# EAGLE design m5stack-2sided-pinheader (EAGLE 8.7.1)
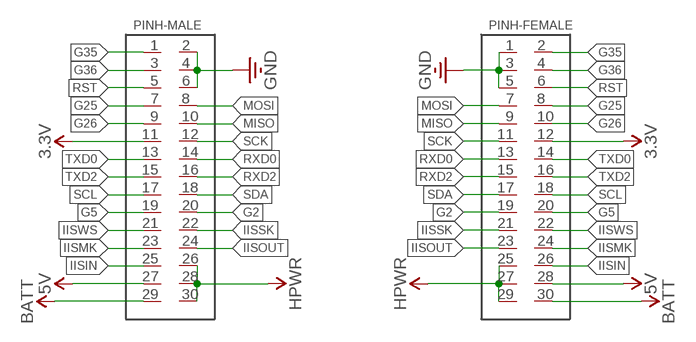
[diagram p0: schematic, sheet 1]

## Parts
PINH-FEMALE  M5STACK-PINHHANDSOLDER  [PINH-2X15-SMD_HANDSOLDER]
PINH-MALE  M5STACK-PINHHANDSOLDER  [PINH-2X15-SMD_HANDSOLDER]

## Nets
3.3V: PINH-FEMALE.12 PINH-MALE.11
5V: PINH-FEMALE.28 PINH-MALE.27
BATT: PINH-FEMALE.30 PINH-MALE.29
G2: PINH-FEMALE.19 PINH-MALE.20
G5: PINH-FEMALE.20 PINH-MALE.19
G25: PINH-FEMALE.8 PINH-MALE.7
G26: PINH-FEMALE.10 PINH-MALE.9
G35: PINH-FEMALE.2 PINH-MALE.1
G36: PINH-FEMALE.4 PINH-MALE.3
GND: PINH-FEMALE.1 PINH-FEMALE.3 PINH-FEMALE.5 PINH-MALE.2 PINH-MALE.4 PINH-MALE.6
HPWR: PINH-FEMALE.25 PINH-FEMALE.27 PINH-FEMALE.29 PINH-MALE.26 PINH-MALE.28 PINH-MALE.30
IISIN: PINH-FEMALE.26 PINH-MALE.25
IISMK: PINH-FEMALE.24 PINH-MALE.23
IISOUT: PINH-FEMALE.23 PINH-MALE.24
IISSK: PINH-FEMALE.21 PINH-MALE.22
IISWS: PINH-FEMALE.22 PINH-MALE.21
MISO: PINH-FEMALE.9 PINH-MALE.10
MOSI: PINH-FEMALE.7 PINH-MALE.8
RST: PINH-FEMALE.6 PINH-MALE.5
RXD0: PINH-FEMALE.13 PINH-MALE.14
RXD2: PINH-FEMALE.15 PINH-MALE.16
SCK: PINH-FEMALE.11 PINH-MALE.12
SCL: PINH-FEMALE.18 PINH-MALE.17
SDA: PINH-FEMALE.17 PINH-MALE.18
TXD0: PINH-FEMALE.14 PINH-MALE.13
TXD2: PINH-FEMALE.16 PINH-MALE.15

## Library data of the parts
PINH-FEMALE PINH-MALE = kenu-m5stack:M5STACK-PINH

## Board
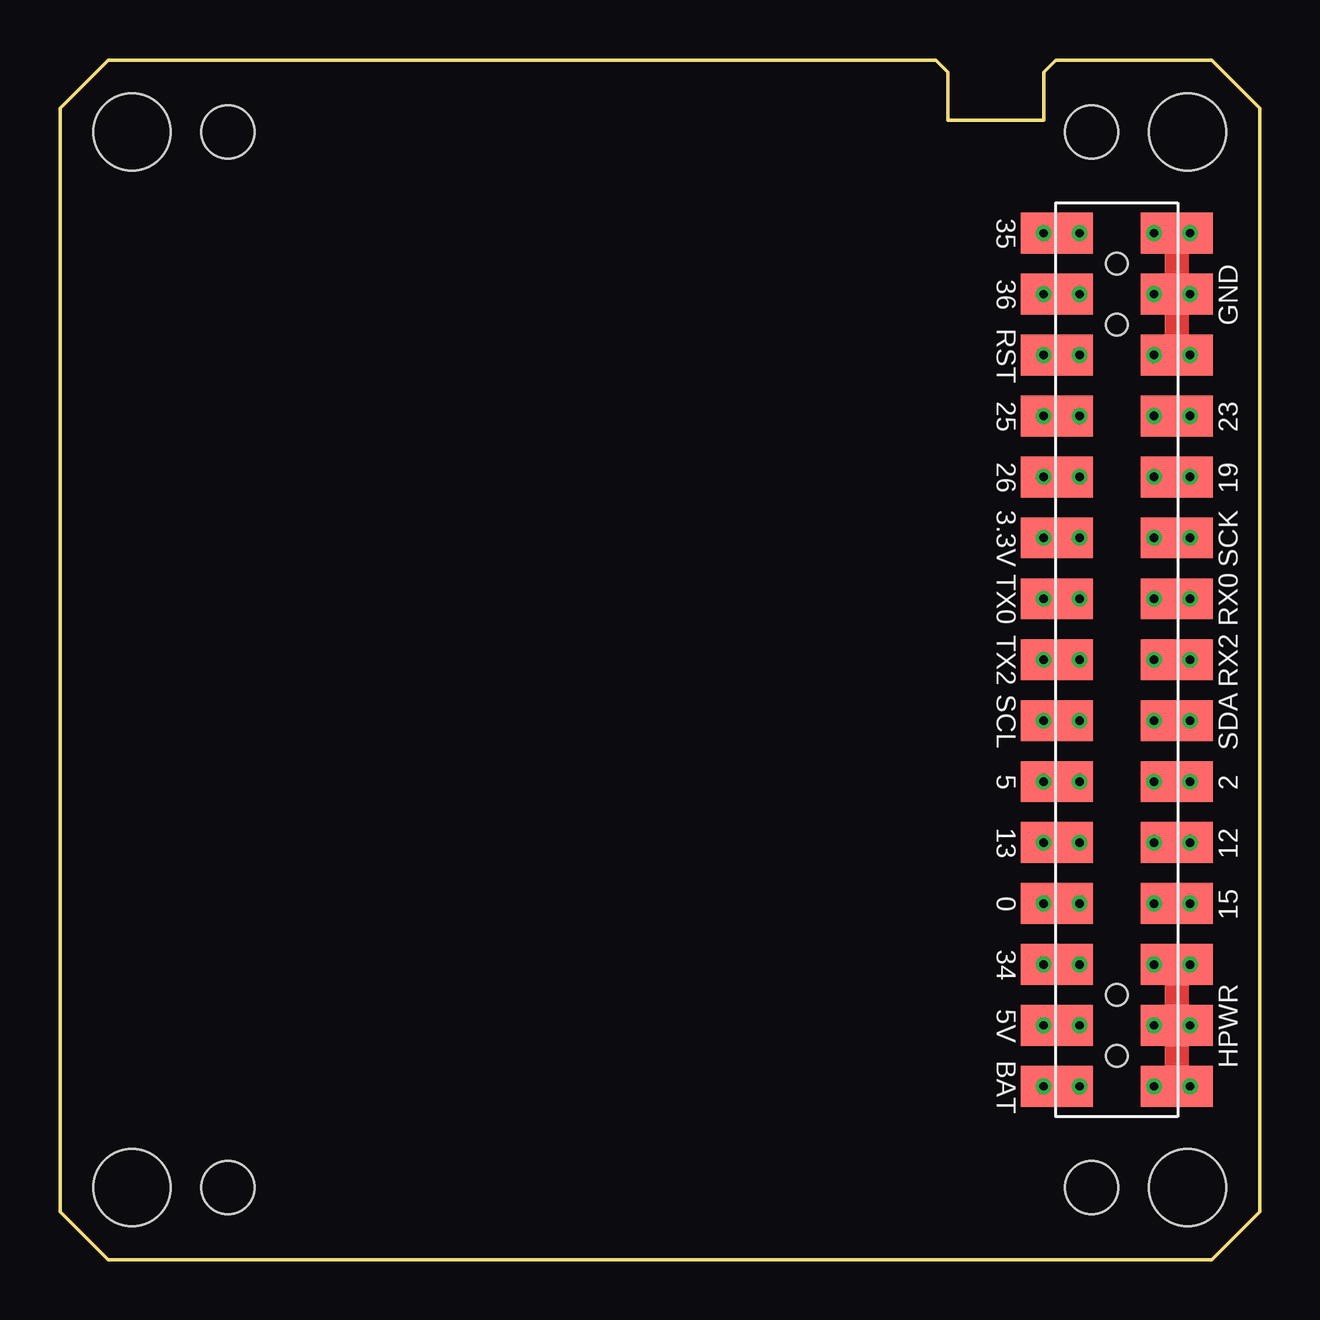
[diagram p1: board, top side]
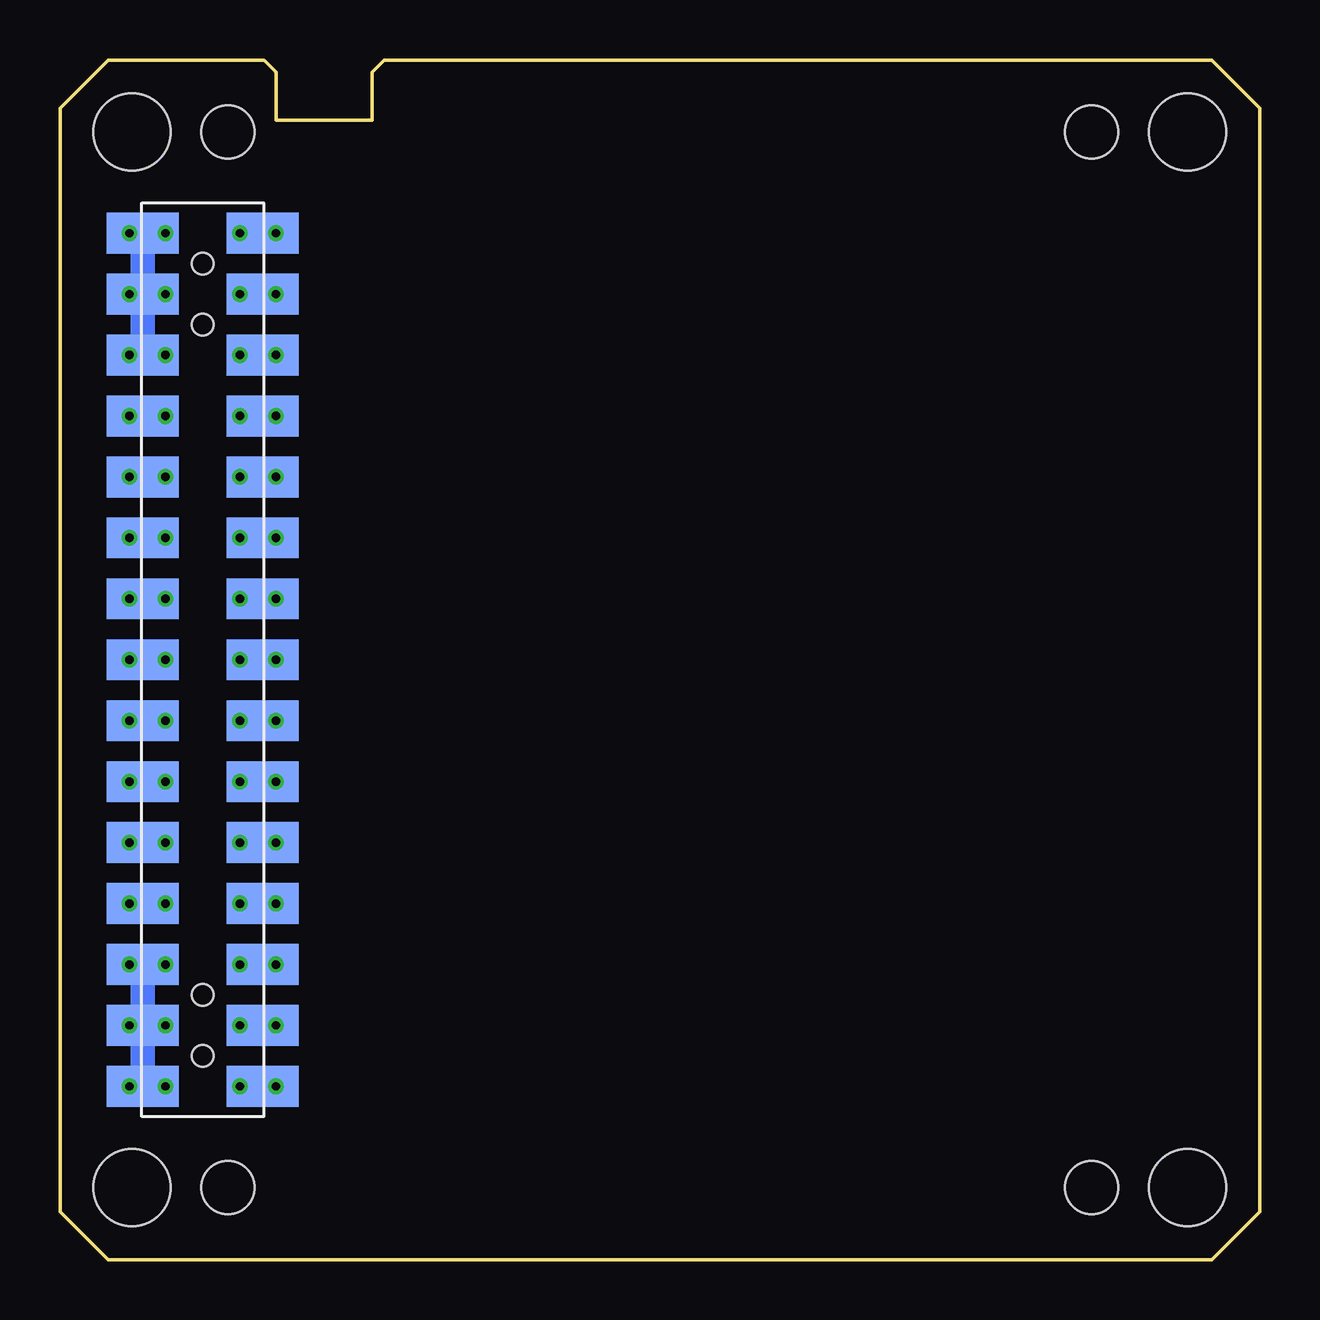
[diagram p2: board, bottom side, seen from below]

Size 50 x 50 mm. Coordinates in mm from the lower left corner, seen from the top.
Outline: 2,0 0,2 0,48 2,50 36.5,50 37,49.5 37,47.5 41,47.5 41,49.5 41.5,50 48,50 50,48 50,2 48,0 2,0
Copper layers (1*16): Top 0.035mm / dielectric 1.5mm / Bottom 0.035mm
Design rules "SeeedStudio_2layer_DRU_no_angle_20140221": minimum track width 6mil, minimum drill 12mil, track to track 6mil, track to pad 6mil, pad to pad 6mil, via to via 6mil, smd to smd 0mil, copper to edge 10mil, drill to drill 10mil, minimum pad ring 10mil, minimum via ring 6mil, stop-mask expansion 2mil, vias tented up to drill 100mil, thermal gap 10mil
Holes 3.2 mm at 3,47 3,3 47,47 47,3
Holes 2.2 mm at 7,47 7,3 43,3 43,47
Holes 0.9 mm at 44.05,41.51 44.05,38.97 44.05,11.03 44.05,8.49

### Footprints (pad centres in the part's own frame; a part is rotated, then mirrored left to right if it is on the bottom)
PINH-2X15-SMD_HANDSOLDER = smd 3 x 1.7: 1 -2.5,17.78; 2 2.5,17.78; 3 -2.5,15.24; 4 2.5,15.24; 5 -2.5,12.7; 6 2.5,12.7; 7 -2.5,10.16; 8 2.5,10.16; 9 -2.5,7.62; 10 2.5,7.62; 11 -2.5,5.08; 12 2.5,5.08; 13 -2.5,2.54; 14 2.5,2.54; 15 -2.5,0; 16 2.5,0; 17 -2.5,-2.54; 18 2.5,-2.54; 19 -2.5,-5.08; 20 2.5,-5.08; 21 -2.5,-7.62; 22 2.5,-7.62; 23 -2.5,-10.16; 24 2.5,-10.16; 25 -2.5,-12.7; 26 2.5,-12.7; 27 -2.5,-15.24; 28 2.5,-15.24; 29 -2.5,-17.78; 30 2.5,-17.78

### Placement (x,y rotation side)
PINH-FEMALE  44.05,25 0 bottom
PINH-MALE  44.05,25 0 top

### Tracks (layer width: path | path; a pad name or v marks a point on that pad's centre or on a via)
3.3V  (via drill 0.35)
  Top 0.152: v42.5,30.08 PINH-FEMALE.12 v41,30.08
  Bottom 0.152: v41,30.08 PINH-FEMALE.12 v42.5,30.08
5V  (via drill 0.35)
  Top 0.152: v41,9.76 PINH-FEMALE.28 v42.5,9.76
  Bottom 0.152: v42.5,9.76 PINH-FEMALE.28 v41,9.76
BATT  (via drill 0.35)
  Top 0.152: v41,7.22 PINH-FEMALE.30 v42.5,7.22
  Bottom 0.152: v41,7.22 PINH-FEMALE.30 v42.5,7.22
G2  (via drill 0.35)
  Top 0.152: v45.6,19.92 PINH-FEMALE.19 v47.1,19.92
  Bottom 0.152: v45.6,19.92 PINH-FEMALE.19 v47.1,19.92
G5  (via drill 0.35)
  Top 0.152: v42.5,19.92 PINH-FEMALE.20 v41,19.92
  Bottom 0.152: v41,19.92 PINH-FEMALE.20 v42.5,19.92
G25  (via drill 0.35)
  Top 0.152: v41,35.16 PINH-MALE.7 v42.5,35.16
  Bottom 0.152: v41,35.16 PINH-MALE.7 v42.5,35.16
G26  (via drill 0.35)
  Top 0.152: v41,32.62 PINH-MALE.9 v42.5,32.62
  Bottom 0.152: v41,32.62 PINH-MALE.9 v42.5,32.62
G35  (via drill 0.35)
  Top 0.152: v41,42.78 PINH-FEMALE.2 v42.5,42.78
  Bottom 0.152: v41,42.78 PINH-FEMALE.2 v42.5,42.78
G36  (via drill 0.35)
  Top 0.152: v41,40.24 PINH-MALE.3 v42.5,40.24
  Bottom 0.152: v41,40.24 PINH-MALE.3 v42.5,40.24
GND  (via drill 0.35)
  Top 0.152: v45.6,42.78 PINH-FEMALE.1 v47.1,42.78 | v45.6,37.7 PINH-FEMALE.5 v47.1,37.7 | PINH-FEMALE.3 v45.6,40.24
  Top 1.016: PINH-FEMALE.1 PINH-FEMALE.3 PINH-FEMALE.5
  Bottom 0.152: v45.6,40.24 PINH-FEMALE.3 v47.1,40.24 | v45.6,37.7 PINH-FEMALE.5 v47.1,37.7 | v47.1,42.78 PINH-FEMALE.1 v45.6,42.78
  Bottom 1.016: PINH-FEMALE.1 PINH-FEMALE.3 PINH-FEMALE.5
HPWR  (via drill 0.35)
  Top 0.152: v45.6,12.3 PINH-FEMALE.25 v47.1,12.3 | v45.6,9.76 PINH-FEMALE.27 v47.1,9.76 | v45.6,7.22 PINH-FEMALE.29 v47.1,7.22
  Top 1.016: PINH-FEMALE.25 PINH-FEMALE.27 PINH-FEMALE.29
  Bottom 0.152: v45.6,9.76 PINH-FEMALE.27 v47.1,9.76 | v45.6,7.22 PINH-FEMALE.29 v47.1,7.22 | v45.6,12.3 PINH-FEMALE.25 v47.1,12.3
  Bottom 1.016: PINH-FEMALE.29 PINH-FEMALE.27 PINH-FEMALE.25
IISIN  (via drill 0.35)
  Top 0.152: v41,12.3 PINH-FEMALE.26 v42.5,12.3
  Bottom 0.152: v41,12.3 PINH-FEMALE.26 v42.5,12.3
IISMK  (via drill 0.35)
  Top 0.152: v41,14.84 PINH-FEMALE.24 v42.5,14.84
  Bottom 0.152: v41,14.84 PINH-FEMALE.24 v42.5,14.84
IISOUT  (via drill 0.35)
  Top 0.152: v45.6,14.84 PINH-FEMALE.23 v47.1,14.84
  Bottom 0.152: v45.6,14.84 PINH-FEMALE.23 v47.1,14.84
IISSK  (via drill 0.35)
  Top 0.152: v45.6,17.38 PINH-FEMALE.21 v47.1,17.38
  Bottom 0.152: v45.6,17.38 PINH-FEMALE.21 v47.1,17.38
IISWS  (via drill 0.35)
  Top 0.152: v42.5,17.38 PINH-FEMALE.22 v41,17.38
  Bottom 0.152: v41,17.38 PINH-FEMALE.22 v42.5,17.38
MISO  (via drill 0.35)
  Top 0.152: v45.6,32.62 PINH-FEMALE.9 v47.1,32.62
  Bottom 0.152: v45.6,32.62 PINH-FEMALE.9 v47.1,32.62
MOSI  (via drill 0.35)
  Top 0.152: v45.6,35.16 PINH-FEMALE.7 v47.1,35.16
  Bottom 0.152: v45.6,35.16 PINH-FEMALE.7 v47.1,35.16
RST  (via drill 0.35)
  Top 0.152: v41,37.7 PINH-MALE.5 v42.5,37.7
  Bottom 0.152: v41,37.7 PINH-MALE.5 v42.5,37.7
RXD0  (via drill 0.35)
  Top 0.152: v45.6,27.54 PINH-FEMALE.13 v47.1,27.54
  Bottom 0.152: v45.6,27.54 PINH-FEMALE.13 v47.1,27.54
RXD2  (via drill 0.35)
  Top 0.152: v45.6,25 PINH-FEMALE.15 v47.1,25
  Bottom 0.152: v45.6,25 PINH-FEMALE.15 v47.1,25
SCK  (via drill 0.35)
  Top 0.152: v45.6,30.08 PINH-FEMALE.11 v47.1,30.08
  Bottom 0.152: v45.6,30.08 PINH-FEMALE.11 v47.1,30.08
SCL  (via drill 0.35)
  Top 0.152: v42.5,22.46 PINH-FEMALE.18 v41,22.46
  Bottom 0.152: v41,22.46 PINH-FEMALE.18 v42.5,22.46
SDA  (via drill 0.35)
  Top 0.152: v45.6,22.46 PINH-FEMALE.17 v47.1,22.46
  Bottom 0.152: v45.6,22.46 PINH-FEMALE.17 v47.1,22.46
TXD0  (via drill 0.35)
  Top 0.152: v41,27.54 PINH-MALE.13 v42.5,27.54
  Bottom 0.152: v41,27.54 PINH-MALE.13 v42.5,27.54
TXD2  (via drill 0.35)
  Top 0.152: v41,25 PINH-MALE.15 v42.5,25
  Bottom 0.152: v41,25 PINH-MALE.15 v42.5,25

### Text on the board
tPlace: 35 | 36 | GND | RST | 25 | 23 | 26 | 19 | 3.3V | SCK | TX0 | RX0 | TX2 | RX2 | SCL | SDA | 5 | 2 | 13 | 12 | 0 | 15 | 34 | 5V | HPWR | BAT